# Altium project Magnetovision_2D_256_2.PrjPcb
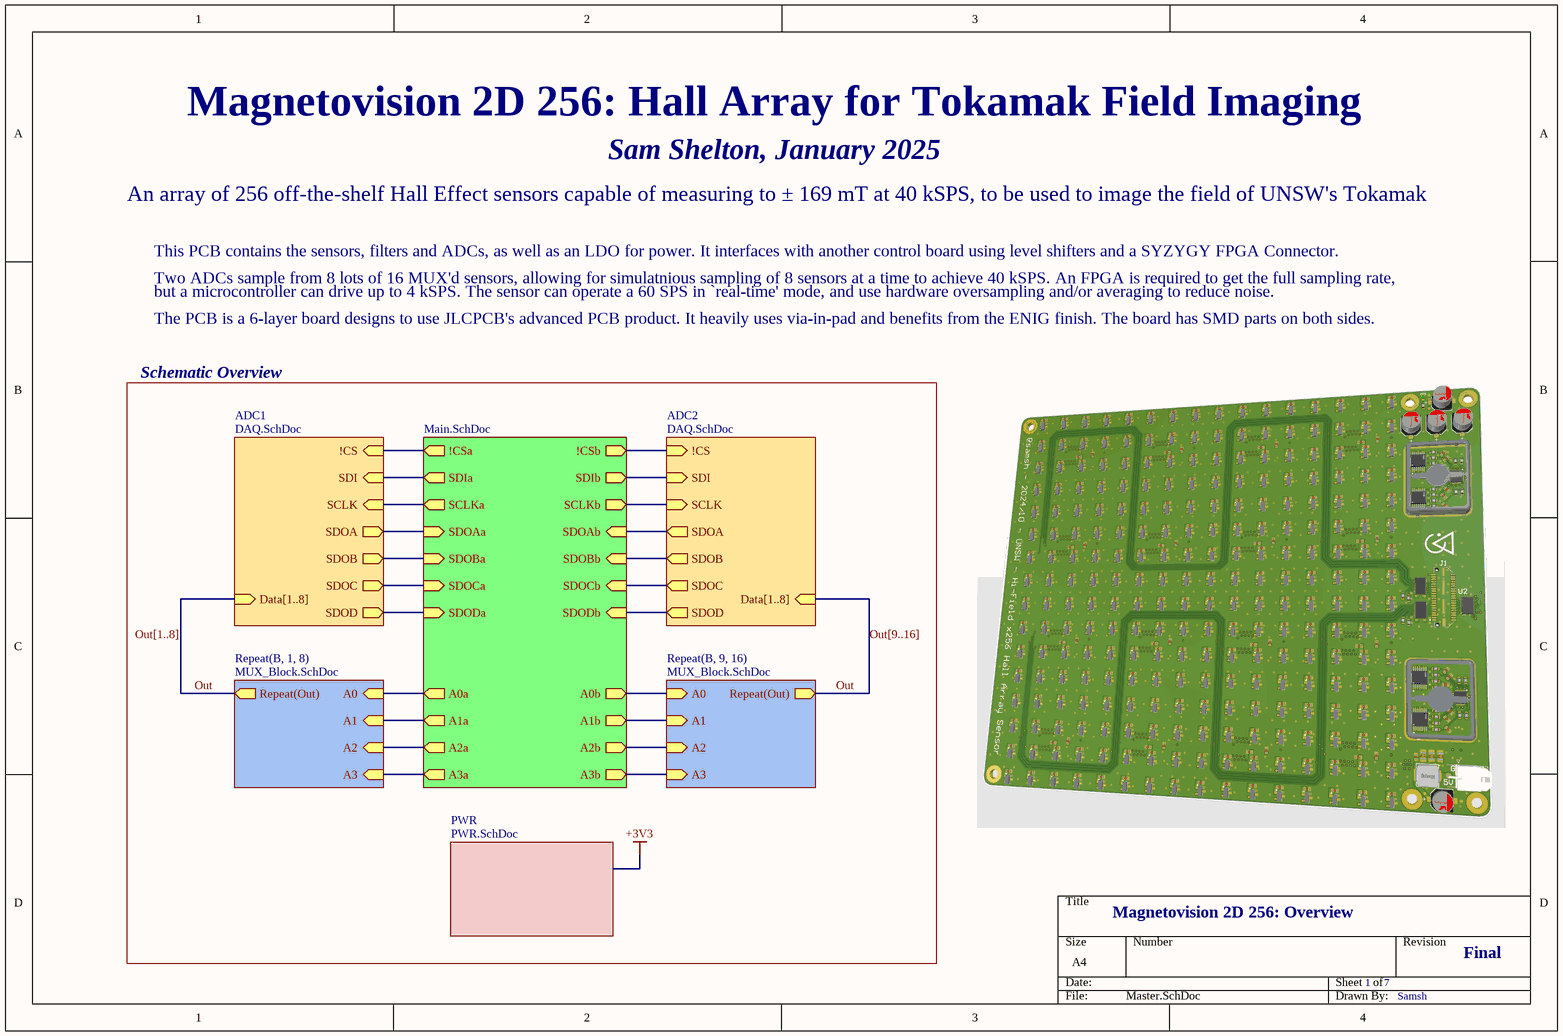
[diagram p0: Master.SchDoc]
7 sheets, 756 parts. Net scope: hierarchical (ports join the sheet entries above them; power ports are global).
Board file: Mag256_9mm.PcbDoc
Sheets:
  Master.SchDoc
    ADC1 = DAQ.SchDoc
      F2 = PreDAQ_Filter.SchDoc
      F1 = PreDAQ_Filter.SchDoc
     = Main.SchDoc
    B1 = MUX_Block.SchDoc
      F1 = PostMUX_Filter.SchDoc
    B2 = MUX_Block.SchDoc
      F1 = PostMUX_Filter.SchDoc
    B3 = MUX_Block.SchDoc
      F1 = PostMUX_Filter.SchDoc
    B4 = MUX_Block.SchDoc
      F1 = PostMUX_Filter.SchDoc
    B5 = MUX_Block.SchDoc
      F1 = PostMUX_Filter.SchDoc
    B6 = MUX_Block.SchDoc
      F1 = PostMUX_Filter.SchDoc
    B7 = MUX_Block.SchDoc
      F1 = PostMUX_Filter.SchDoc
    B8 = MUX_Block.SchDoc
      F1 = PostMUX_Filter.SchDoc
    ADC2 = DAQ.SchDoc
      F2 = PreDAQ_Filter.SchDoc
      F1 = PreDAQ_Filter.SchDoc
    B9 = MUX_Block.SchDoc
      F1 = PostMUX_Filter.SchDoc
    B10 = MUX_Block.SchDoc
      F1 = PostMUX_Filter.SchDoc
    B11 = MUX_Block.SchDoc
      F1 = PostMUX_Filter.SchDoc
    B12 = MUX_Block.SchDoc
      F1 = PostMUX_Filter.SchDoc
    B13 = MUX_Block.SchDoc
      F1 = PostMUX_Filter.SchDoc
    B14 = MUX_Block.SchDoc
      F1 = PostMUX_Filter.SchDoc
    B15 = MUX_Block.SchDoc
      F1 = PostMUX_Filter.SchDoc
    B16 = MUX_Block.SchDoc
      F1 = PostMUX_Filter.SchDoc
    PWR = PWR.SchDoc

## Sheet Master.SchDoc
size A4; SheetNumber: 1; SheetTotal: 7

### Sub-sheets
ADC1 = DAQ.SchDoc: Data[1..8] (in), !CS (in), SDOA (out), SDI (in), SCLK (in), SDOB (out), SDOC (out), SDOD (out)
ADC2 = DAQ.SchDoc: Data[1..8] (in), !CS (in), SDOA (out), SDI (in), SCLK (in), SDOB (out), SDOC (out), SDOD (out)
PWR = PWR.SchDoc: no entries
Repeat(B, 1, 8) = MUX_Block.SchDoc: A0 (in), A1 (in), A2 (in), A3 (in), Repeat(Out) (out)
Repeat(B, 9, 16) = MUX_Block.SchDoc: A0 (in), A1 (in), A2 (in), A3 (in), Repeat(Out) (out)
? = Main.SchDoc: SDOAa (in), SDIa (out), !CSa (out), !CSb (out), SDOBa (in), A0a (out), A1a (out), A2a (out), A3a (out), A0b (out), A1b (out), A2b (out), A3b (out), SDOCa (in), SDODa (in), SCLKa (out), SDOAb (in), SDIb (out), SDOBb (in), SDOCb (in), SDODb (in), SCLKb (out)

### Nets
Out: sheet Repeat(B, 1, 8)/Repeat(Out), sheet Repeat(B, 9, 16)/Repeat(Out)
NetIC1_ADC1_18: sheet ADC1/!CS, sheet /!CSa
NetIC1_ADC1_21: sheet ADC1/SDI, sheet /SDIa
NetIC1_ADC1_22: sheet ADC1/SCLK, sheet /SCLKa
NetIC1_ADC2_18: sheet /!CSb, sheet ADC2/!CS
NetIC1_ADC2_21: sheet /SDIb, sheet ADC2/SDI
NetIC1_ADC2_22: sheet /SCLKb, sheet ADC2/SCLK
NetR1_ADC1_2: sheet ADC1/SDOC, sheet /SDOCa
NetR1_ADC2_2: sheet /SDOCb, sheet ADC2/SDOC
NetR2_ADC1_1: sheet ADC1/SDOB, sheet /SDOBa
NetR2_ADC2_1: sheet /SDOBb, sheet ADC2/SDOB
NetR3_ADC1_2: sheet ADC1/SDOD, sheet /SDODa
NetR3_ADC2_2: sheet /SDODb, sheet ADC2/SDOD
NetR4_ADC1_1: sheet ADC1/SDOA, sheet /SDOAa
NetR4_ADC2_1: sheet /SDOAb, sheet ADC2/SDOA
NetU1_15: sheet /A3a, sheet Repeat(B, 1, 8)/A3
NetU1_16: sheet /A2a, sheet Repeat(B, 1, 8)/A2
NetU1_17: sheet /A1a, sheet Repeat(B, 1, 8)/A1
NetU1_18: sheet /A0a, sheet Repeat(B, 1, 8)/A0
NetU3_15: sheet /A3b, sheet Repeat(B, 9, 16)/A3
NetU3_16: sheet /A2b, sheet Repeat(B, 9, 16)/A2
NetU3_17: sheet /A1b, sheet Repeat(B, 9, 16)/A1
NetU3_18: sheet /A0b, sheet Repeat(B, 9, 16)/A0

### Buses and harness runs
bus Out[1..8] = sheet ADC1/Data[1..8]
bus Out[9..16] = sheet ADC2/Data[1..8]

### Notes on the sheet
- Magnetovision 2D 256: Hall Array for Tokamak Field Imaging
- Sam Shelton, January 2025
- An array of 256 off-the-shelf Hall Effect sensors capable of measuring to ± 169 mT at 40 kSPS, to be used to image the field of UNSW's Tokamak
- This PCB contains the sensors, filters and ADCs, as well as an LDO for power. It interfaces with another control board using level shifters and a SYZYGY FPGA Connector.
- Two ADCs sample from 8 lots of 16 MUX'd sensors, allowing for simulatnious sampling of 8 sensors at a time to achieve 40 kSPS. An FPGA is required to get the full sampling rate,
- but a microcontroller can drive up to 4 kSPS. The sensor can operate a 60 SPS in `real-time' mode, and use hardware oversampling and/or averaging to reduce noise.
- Schematic Overview
- The PCB is a 6-layer board designs to use JLCPCB's advanced PCB product. It heavily uses via-in-pad and benefits from the ENIG finish. The board has SMD parts on both sides.
- Magnetovision 2D 256: Overview
- 1
- 7
- Final
- Samsh

## Sheet DAQ.SchDoc
size A4; SheetNumber: 3; SheetTotal: 7
Used 2 times, as channels ADC1, ADC2. Parts and nets are listed once, with the designators drawn on the sheet.
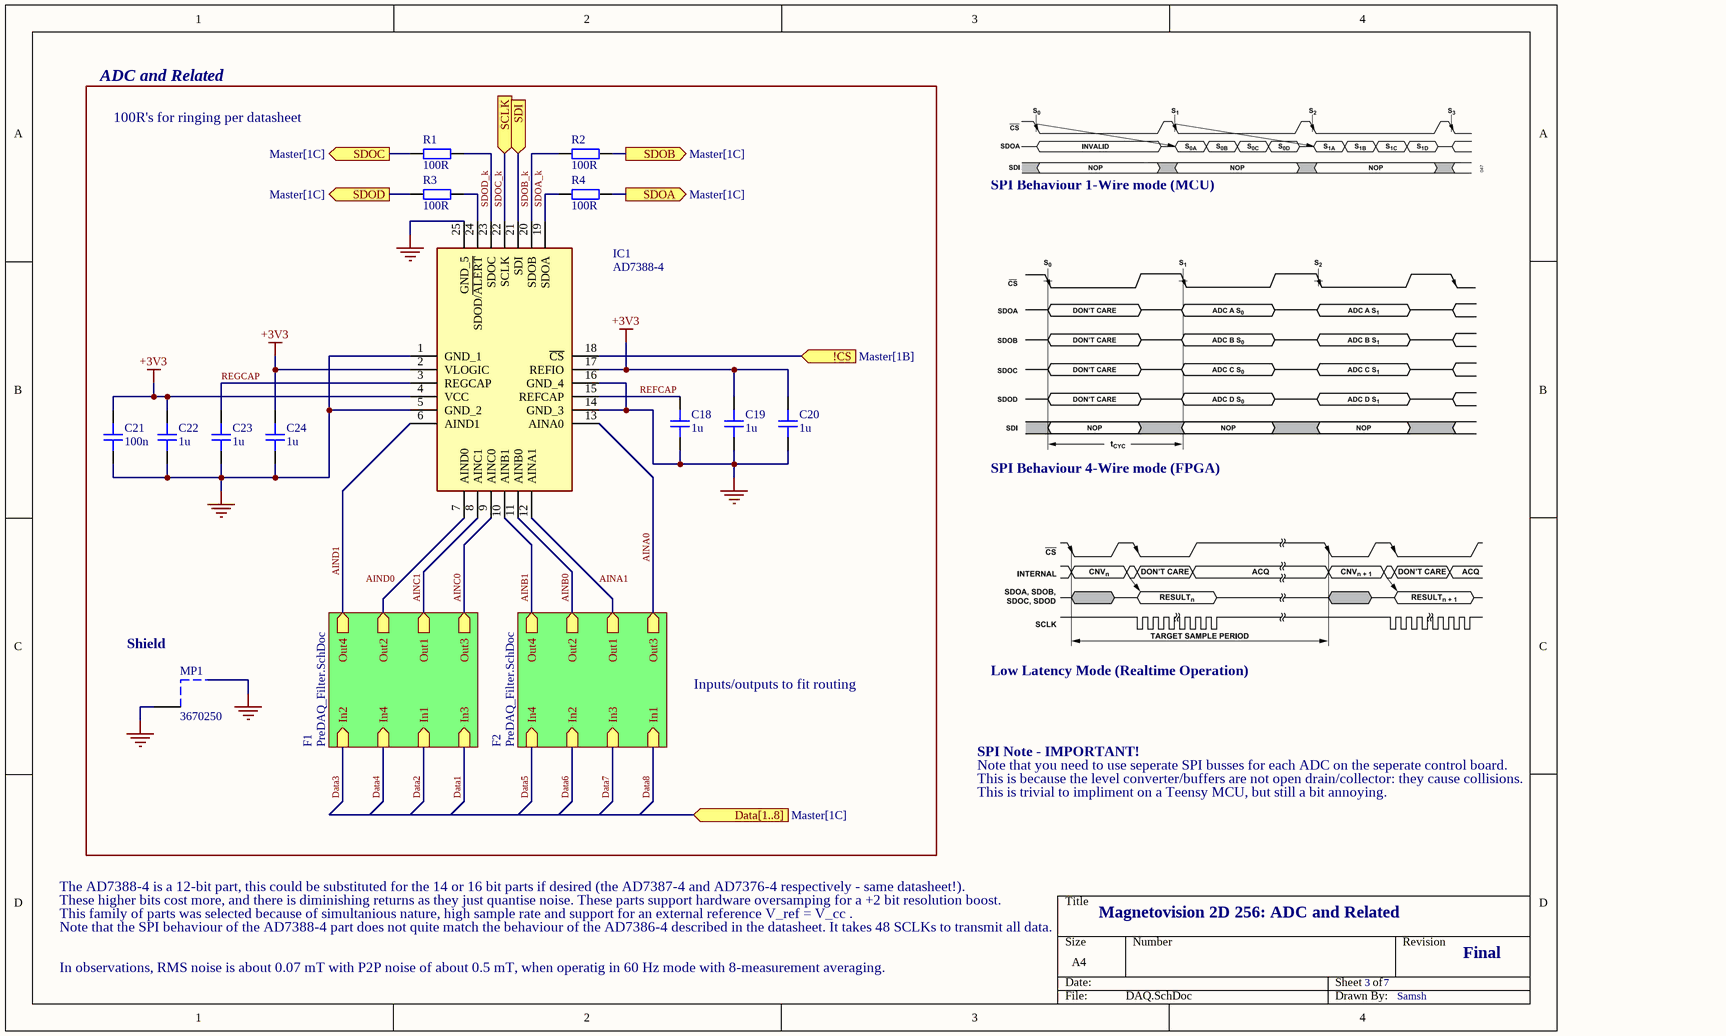
[diagram p1: DAQ.SchDoc]

### Parts
C18  1u  [CAP_0603]
C19  1u  [CAP_0603]
C20  1u  [CAP_0603]
C21  100n  [CAP_0603]
C22  1u  [CAP_0603]
C23  1u  [CAP_0603]
C24  1u  [CAP_0603]
IC1  AD7388-4  [QFN50P400X400X60-25N-D]
MP1  3670250  [3670250]
R1  100R  [RES_0603]
R2  100R  [RES_0603]
R3  100R  [RES_0603]
R4  100R  [RES_0603]

### Sub-sheets
F1 = PreDAQ_Filter.SchDoc: In1 (in), Out1 (out), In2 (in), Out2 (out), In4 (in), Out4 (out), In3 (in), Out3 (out)
F2 = PreDAQ_Filter.SchDoc: In1 (in), Out1 (out), In2 (in), Out2 (out), In4 (in), Out4 (out), In3 (in), Out3 (out)

### Ports
!CS (in, see Master[1B]), Data[1..8] (in, see Master[1C]), SCLK (in, see Master[1B]), SDI (in, see Master[1B]), SDOA (out, see Master[1C]), SDOB (out, see Master[1C]), SDOC (out, see Master[1C]), SDOD (out, see Master[1C])

### Nets
+3V3: C19.2 C20.2 C21.2 C22.2 C24.2 IC1.2(VLOGIC) IC1.4(VCC) IC1.17(REFIO)
GND: C18.1 C19.1 C20.1 C21.1 C22.1 C23.1 C24.1 IC1.1(GND_1) IC1.5(GND_2) IC1.14(GND_3) IC1.16(GND_4) IC1.25(GND_5) MP1.1
!CS: IC1.18(~{CS}) ; port !CS
AINA0: IC1.13(AINA0) ; sheet F2/Out3
AINA1: IC1.12(AINA1) ; sheet F2/Out1
AINB0: IC1.11(AINB0) ; sheet F2/Out2
AINB1: IC1.10(AINB1) ; sheet F2/Out4
AINC0: IC1.9(AINC0) ; sheet F1/Out3
AINC1: IC1.8(AINC1) ; sheet F1/Out1
AIND0: IC1.7(AIND0) ; sheet F1/Out2
AIND1: IC1.6(AIND1) ; sheet F1/Out4
REFCAP: C18.2 IC1.15(REFCAP)
REGCAP: C23.2 IC1.3(REGCAP)
SCLK: IC1.22(SCLK) ; port SCLK
SDI: IC1.21(SDI) ; port SDI
SDOA: R4.1 ; port SDOA
SDOA_k: IC1.19(SDOA) R4.2
SDOB: R2.1 ; port SDOB
SDOB_k: IC1.20(SDOB) R2.2
SDOC: R1.2 ; port SDOC
SDOC_k: IC1.23(SDOC) R1.1
SDOD: R3.2 ; port SDOD
SDOD_k: IC1.24(SDOD/~{ALERT}) R3.1

### Channels
ADC1: designators end in _ADC1; ports !CS=NetIC1_ADC1_18 SCLK=NetIC1_ADC1_22 SDI=NetIC1_ADC1_21 SDOA=NetR4_ADC1_1 SDOB=NetR2_ADC1_1 SDOC=NetR1_ADC1_2 SDOD=NetR3_ADC1_2
ADC2: designators end in _ADC2; ports !CS=NetIC1_ADC2_18 SCLK=NetIC1_ADC2_22 SDI=NetIC1_ADC2_21 SDOA=NetR4_ADC2_1 SDOB=NetR2_ADC2_1 SDOC=NetR1_ADC2_2 SDOD=NetR3_ADC2_2

### Notes on the sheet
- ADC and Related
- 100R's for ringing per datasheet
- SPI Behaviour 1-Wire mode (MCU)
- SPI Behaviour 4-Wire mode (FPGA)
- Shield
- Inputs/outputs to fit routing
- Low Latency Mode (Realtime Operation)
- Note that you need to use seperate SPI busses for each ADC on the seperate control board.
- This is because the level converter/buffers are not open drain/collector: they cause collisions.
- SPI Note - IMPORTANT!
- This is trivial to impliment on a Teensy MCU, but still a bit annoying.
- The AD7388-4 is a 12-bit part, this could be substituted for the 14 or 16 bit parts if desired (the AD7387-4 and AD7376-4 respectively - same datasheet!).
- These higher bits cost more, and there is diminishing returns as they just quantise noise. These parts support hardware oversamping for a +2 bit resolution boost.
- This family of parts was selected because of simultanious nature, high sample rate and support for an external reference V_ref = V_cc .
- Magnetovision 2D 256: ADC and Related
- In observations, RMS noise is about 0.07 mT with P2P noise of about 0.5 mT, when operatig in 60 Hz mode with 8-measurement averaging.
- Note that the SPI behaviour of the AD7388-4 part does not quite match the behaviour of the AD7386-4 described in the datasheet. It takes 48 SCLKs to transmit all data.
- 3
- 7
- Final
- Samsh

### Library data of the parts
C18-C24 = CMP-001-00085-1: Capacitor SMD 0603; Distributor Link: *; LCSC: *; Design Item ID: CAP_0603; Rating: *; Source: Schematic-Lib-PhilsLab.SchLib; Manufacturer Part Number: *; Manufacturer: *; Dielectric: *
IC1 = CMP-031-00040-2: Single-Ended Input, Quad, Simultaneous Sampling, 16-Bit, SAR ADC; Manufacturer_Name: Analog Devices; Height: 0.6mm; Source: SamacSys.SchLib; Manufacturer_Part_Number: AD7386-4BCPZ; Arrow Price/Stock: https://www.arrow.com/en/products/ad7386-4bcpz/analog-devices?region=nac; Arrow Part Number: AD7386-4; Mouser Price/Stock: https://www.mouser.co.uk/ProductDetail/Analog-Devices/AD7386-4BCPZ?qs=ST9lo4GX8V1C1Qgul%252B8gdQ%3D%3D; Datasheet Link: https://www.analog.com/AD7386-4/datasheet; Mouser Part Number: 584-AD7386-4BCPZ; Design Item ID: AD7386-4BCPZ
MP1 = CMP-03913-115851622-1: 3670250 Shield Cabinet Frame, 25Mm X 21Mm Rohs Compliant: Yes; Core Material: Steel; Max Operating Temperature: 125°C; Height: 4mm; RoHS: Compliant; Length: 25mm; Width: 21mm; NexarPartId: 115851622; Min Operating Temperature: -40°C
R1-R4 = CMP-009-00179-1: Resistor SMD 0603; Manufacturer Part Number: *; Distributor Link: *; Source: Schematic-Lib-PhilsLab.SchLib; Manufacturer: *; Design Item ID: RES_0603; LCSC: *

## Sheet PreDAQ_Filter.SchDoc
size A4; SheetNumber: 4; SheetTotal: 7
Used 4 times, as channels ADC1/F2, ADC1/F1, ADC2/F2, ADC2/F1. Parts and nets are listed once, with the designators drawn on the sheet.
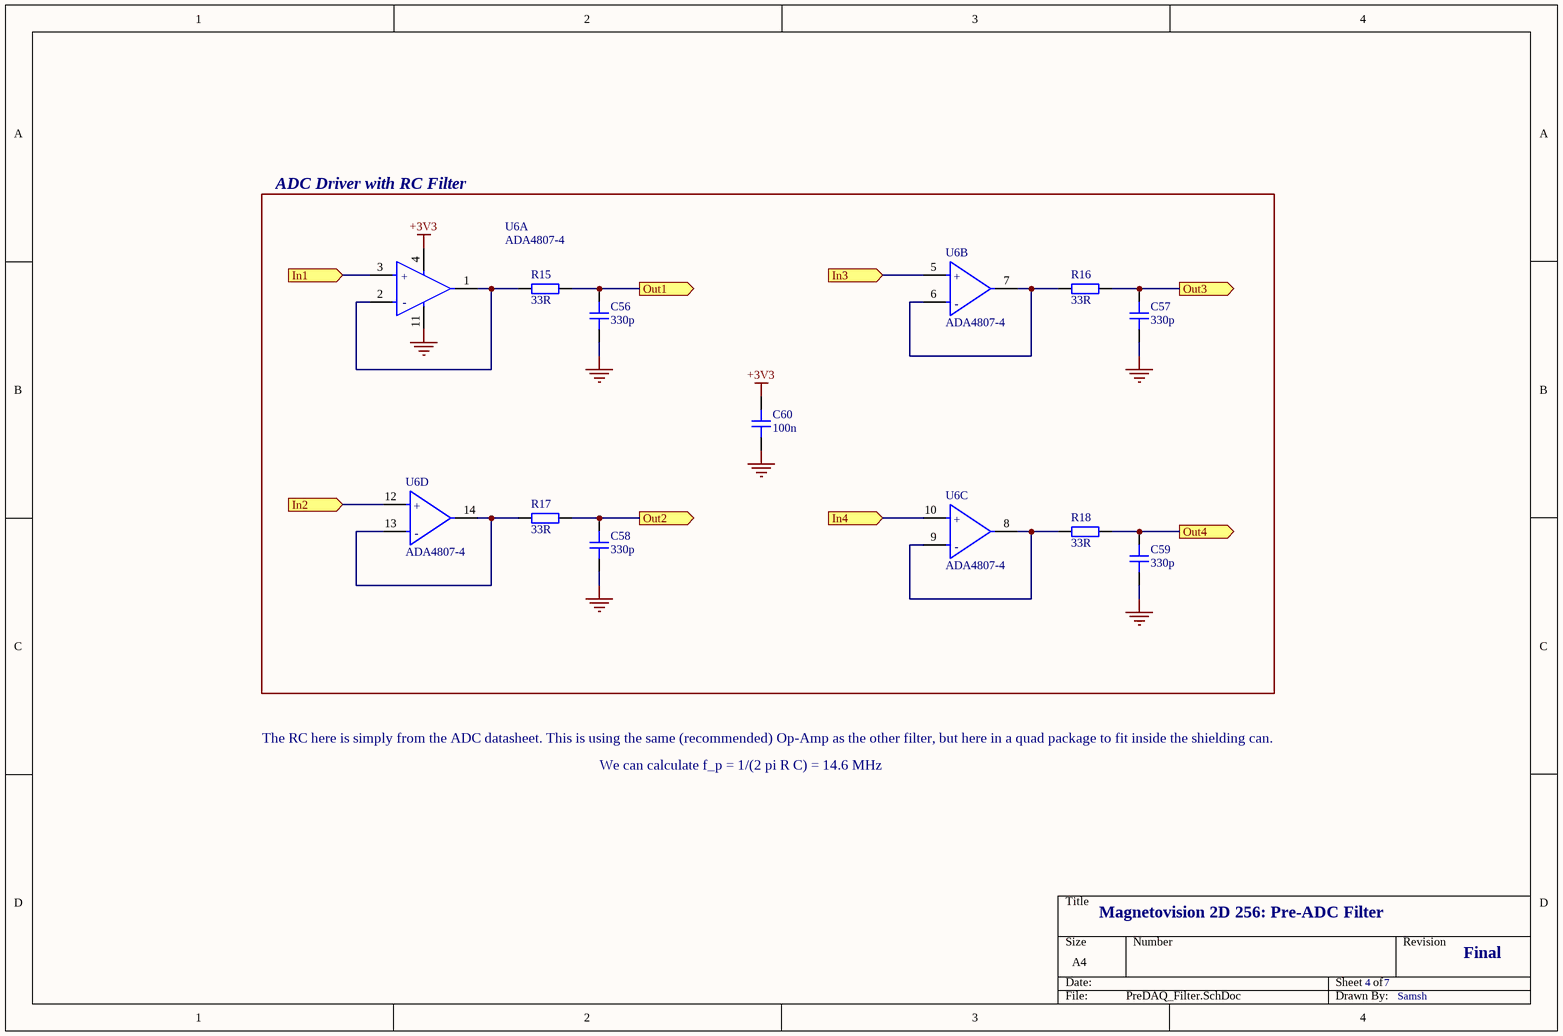
[diagram p2: PreDAQ_Filter.SchDoc]

### Parts
C56  330p  [CAP_0603]
C57  330p  [CAP_0603]
C58  330p  [CAP_0603]
C59  330p  [CAP_0603]
C60  100n  [CAP_0603]
R15  33R  [RES_0603]
R16  33R  [RES_0603]
R17  33R  [RES_0603]
R18  33R  [RES_0603]
U6  ADA4807-4  [FP-RU-14-IPC_A]  (parts A,B,C,D of 4)

### Blocks framed on the sheet
ADC Driver with RC Filter: C56-C60 R15-R18 U6

### Ports
In1 (in, see DAQ[2C]), In2 (in, see DAQ[1C]), In3 (in, see DAQ[2C]), In4 (in, see DAQ[1C]), Out1 (out, see DAQ[2C]), Out2 (out, see DAQ[1C]), Out3 (out, see DAQ[2C]), Out4 (out, see DAQ[1C])

### Nets
+3V3: C60.2 U6.4(+VS)
GND: C56.1 C57.1 C58.1 C59.1 C60.1 U6.11(-VS)
In1: U6.3(+IN1) ; port In1
In2: U6.12(+IN4) ; port In2
In3: U6.5(+IN2) ; port In3
In4: U6.10(+IN3) ; port In4
Out1: C56.2 R15.1 ; port Out1
Out2: C58.2 R17.1 ; port Out2
Out3: C57.2 R16.1 ; port Out3
Out4: C59.2 R18.1 ; port Out4
NetR15_2: R15.2 U6.1(VOUT1) U6.2(-IN1)
NetR16_2: R16.2 U6.6(-IN2) U6.7(VOUT2)
NetR17_2: R17.2 U6.13(-IN4) U6.14(VOUT4)
NetR18_2: R18.2 U6.8(VOUT3) U6.9(-IN3)

### Channels
ADC1/F2: designators end in _ADC1_F2; ports In1=Data8_ADC1 In2=Data6_ADC1 In3=Data7_ADC1 In4=Data5_ADC1 Out1=AINA1_ADC1 Out2=AINB0_ADC1 Out3=AINA0_ADC1 Out4=AINB1_ADC1
ADC1/F1: designators end in _ADC1_F1; ports In1=Data2_ADC1 In2=Data3_ADC1 In3=Data1_ADC1 In4=Data4_ADC1 Out1=AINC1_ADC1 Out2=AIND0_ADC1 Out3=AINC0_ADC1 Out4=AIND1_ADC1
ADC2/F2: designators end in _ADC2_F2; ports In1=Data8_ADC2 In2=Data6_ADC2 In3=Data7_ADC2 In4=Data5_ADC2 Out1=AINA1_ADC2 Out2=AINB0_ADC2 Out3=AINA0_ADC2 Out4=AINB1_ADC2
ADC2/F1: designators end in _ADC2_F1; ports In1=Data2_ADC2 In2=Data3_ADC2 In3=Data1_ADC2 In4=Data4_ADC2 Out1=AINC1_ADC2 Out2=AIND0_ADC2 Out3=AINC0_ADC2 Out4=AIND1_ADC2

### Notes on the sheet
- The RC here is simply from the ADC datasheet. This is using the same (recommended) Op-Amp as the other filter, but here in a quad package to fit inside the shielding can.
- We can calculate f_p = 1/(2 pi R C) = 14.6 MHz
- Magnetovision 2D 256: Pre-ADC Filter
- 4
- 7
- Final
- Samsh
- (in symbol CMP-09116-000241-1, part A) +; -
- (in symbol CMP-09116-000241-1, part B) +; -
- (in symbol CMP-09116-000241-1, part C) +; -
- (in symbol CMP-09116-000241-1, part D) +; -

### Library data of the parts
C56-C60 = CMP-001-00085-1: Capacitor SMD 0603; Distributor Link: *; LCSC: *; Design Item ID: CAP_0603; Rating: *; Source: Schematic-Lib-PhilsLab.SchLib; Manufacturer Part Number: *; Manufacturer: *; Dielectric: *
R15-R18 = CMP-009-00179-1: Resistor SMD 0603; Manufacturer Part Number: *; Distributor Link: *; Source: Schematic-Lib-PhilsLab.SchLib; Manufacturer: *; Design Item ID: RES_0603; LCSC: *
U6 = CMP-09116-000241-1: IC OPAMP VFB 4 CIRCUIT 14TSSOP; Input Bias Current: 1.2uA; Min Supply Voltage: 2.7V; -3db Bandwidth: 180MHz; Number of Circuits: 4; Gain Bandwidth Product: 170MHz; Dual Supply Voltage: 5V; Power Supply Rejection Ratio (PSRR): 98dB; Common Mode Rejection Ratio: 96dB; Output Current per Channel: 80mA; Input Offset Voltage (Vos): 140uV; Voltage Gain: 130dB; Slew Rate: 225V/µs; Max Supply Voltage: 11V; Operating Supply Current: 1mA; Lead Free: Contains Lead; Number of Pins: 14; Packaging: Rail/Tube; Mount: Surface Mount; Bandwidth: 180MHz; RoHS Compliant: Yes; Max Operating Temperature: 125°C; Min Operating Temperature: -40°C; Number of Amplifiers: 4; REACH SVHC: No SVHC; Case/Package: TSSOP

## Sheet Main.SchDoc
size A4; SheetNumber: 2; SheetTotal: 7
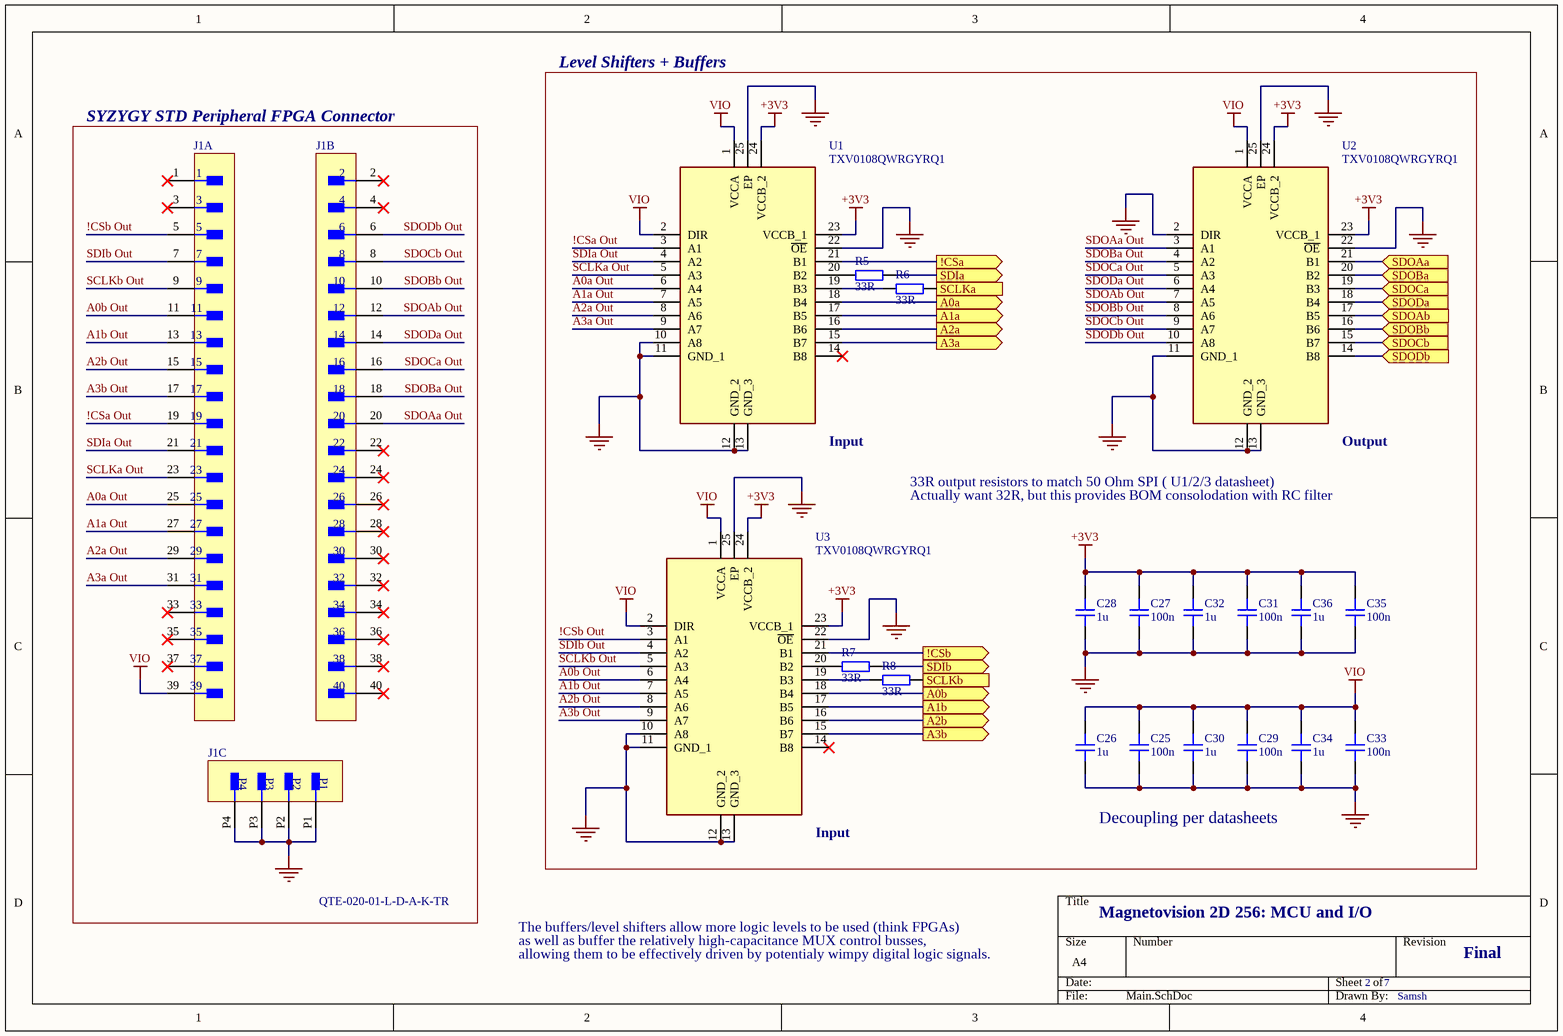
[diagram p3: Main.SchDoc]

### Parts
C25  100n  [CAP_0603]
C26  1u  [CAP_0603]
C27  100n  [CAP_0603]
C28  1u  [CAP_0603]
C29  100n  [CAP_0603]
C30  1u  [CAP_0603]
C31  100n  [CAP_0603]
C32  1u  [CAP_0603]
C33  100n  [CAP_0603]
C34  1u  [CAP_0603]
C35  100n  [CAP_0603]
C36  1u  [CAP_0603]
J1  QTE-020-01-L-D-A-K-TR  [FP-QTE-020-01-L-D-A-K-TR_MFG]  (value not drawn)  (parts A,B,C of 3)
R5  33R  [RES_0603]
R6  33R  [RES_0603]
R7  33R  [RES_0603]
R8  33R  [RES_0603]
U1  TXV0108QWRGYRQ1  [TXV0108QWRGYRQ1]
U2  TXV0108QWRGYRQ1  [TXV0108QWRGYRQ1]
U3  TXV0108QWRGYRQ1  [TXV0108QWRGYRQ1]

### Blocks framed on the sheet
SYZYGY STD Peripheral FPGA Connector: J1

### Ports
!CSa (out, see Master[2B]), !CSb (out, see Master[2B]), A0a (out, see Master[2C]), A0b (out, see Master[2C]), A1a (out, see Master[2C]), A1b (out, see Master[2C]), A2a (out, see Master[2C]), A2b (out, see Master[2C]), A3a (out, see Master[2D]), A3b (out, see Master[2D]), SCLKa (out, see Master[2B]), SCLKb (out, see Master[2B]), SDIa (out, see Master[2B]), SDIb (out, see Master[2B]), SDOAa (in, see Master[2C]), SDOAb (in, see Master[2C]), SDOBa (in, see Master[2C]), SDOBb (in, see Master[2C]), SDOCa (in, see Master[2C]), SDOCb (in, see Master[2C]), SDODa (in, see Master[2C]), SDODb (in, see Master[2C])

### Nets
+3V3: C27.2 C28.2 C31.2 C32.2 C35.2 C36.2 U1.23(VCCB_1) U1.24(VCCB_2) U2.23(VCCB_1) U2.24(VCCB_2) U3.23(VCCB_1) U3.24(VCCB_2)
GND: C25.1 C26.1 C27.1 C28.1 C29.1 C30.1 C31.1 C32.1 C33.1 C34.1 C35.1 C36.1 J1.P1 J1.P2 J1.P3 J1.P4 U1.10(A8) U1.11(GND_1) U1.12(GND_2) U1.13(GND_3) U1.22(~{OE}) U1.25(EP) U2.2(DIR) U2.11(GND_1) U2.12(GND_2) U2.13(GND_3) U2.22(~{OE}) U2.25(EP) U3.10(A8) U3.11(GND_1) U3.12(GND_2) U3.13(GND_3) U3.22(~{OE}) U3.25(EP)
VIO: C25.2 C26.2 C29.2 C30.2 C33.2 C34.2 J1.39 U1.1(VCCA) U1.2(DIR) U2.1(VCCA) U3.1(VCCA) U3.2(DIR)
!CSa Out: J1.19 U1.3(A1)
!CSb Out: J1.5 U3.3(A1)
A0a Out: J1.25 U1.6(A4)
A0b Out: J1.11 U3.6(A4)
A1a Out: J1.27 U1.7(A5)
A1b Out: J1.13 U3.7(A5)
A2a Out: J1.29 U1.8(A6)
A2b Out: J1.15 U3.8(A6)
A3a Out: J1.31 U1.9(A7)
A3b Out: J1.17 U3.9(A7)
SCLKa Out: J1.23 U1.5(A3)
SCLKb Out: J1.9 U3.5(A3)
SDIa Out: J1.21 U1.4(A2)
SDIb Out: J1.7 U3.4(A2)
SDOAa Out: J1.20 U2.3(A1)
SDOAb Out: J1.12 U2.7(A5)
SDOBa Out: J1.18 U2.4(A2)
SDOBb Out: J1.10 U2.8(A6)
SDOCa Out: J1.16 U2.5(A3)
SDOCb Out: J1.8 U2.9(A7)
SDODa Out: J1.14 U2.6(A4)
SDODb Out: J1.6 U2.10(A8)
NetIC1_ADC1_18: U1.21(B1) ; port !CSa
NetIC1_ADC1_21: R5.1 ; port SDIa
NetIC1_ADC1_22: R6.1 ; port SCLKa
NetIC1_ADC2_18: U3.21(B1) ; port !CSb
NetIC1_ADC2_21: R7.1 ; port SDIb
NetIC1_ADC2_22: R8.1 ; port SCLKb
NetR1_ADC1_2: U2.19(B3) ; port SDOCa
NetR1_ADC2_2: U2.15(B7) ; port SDOCb
NetR2_ADC1_1: U2.20(B2) ; port SDOBa
NetR2_ADC2_1: U2.16(B6) ; port SDOBb
NetR3_ADC1_2: U2.18(B4) ; port SDODa
NetR3_ADC2_2: U2.14(B8) ; port SDODb
NetR4_ADC1_1: U2.21(B1) ; port SDOAa
NetR4_ADC2_1: U2.17(B5) ; port SDOAb
NetR5_2: R5.2 U1.20(B2)
NetR6_2: R6.2 U1.19(B3)
NetR7_2: R7.2 U3.20(B2)
NetR8_2: R8.2 U3.19(B3)
NetU1_15: U1.15(B7) ; port A3a
NetU1_16: U1.16(B6) ; port A2a
NetU1_17: U1.17(B5) ; port A1a
NetU1_18: U1.18(B4) ; port A0a
NetU3_15: U3.15(B7) ; port A3b
NetU3_16: U3.16(B6) ; port A2b
NetU3_17: U3.17(B5) ; port A1b
NetU3_18: U3.18(B4) ; port A0b

Not connected (* = marked no-connect by the designer): J1 1* 2* 3* 4* 22* 24* 26* 28* 30* 32* 33* 34* 35* 36* 37* 38* 40*; U1 14(B8)*; U3 14(B8)*

### Notes on the sheet
- Level Shifters + Buffers
- (near U1) Input
- (near U2) Output
- (near U2) 33R output resistors to match 50 Ohm SPI ( U1/2/3 datasheet)
- Actually want 32R, but this provides BOM consolodation with RC filter
- (near U3) Input
- Decoupling per datasheets
- Magnetovision 2D 256: MCU and I/O
- The buffers/level shifters allow more logic levels to be used (think FPGAs)
- as well as buffer the relatively high-capacitance MUX control busses,
- allowing them to be effectively driven by potentialy wimpy digital logic signals.
- 2
- 7
- Final
- Samsh

### Library data of the parts
C25-C36 = CMP-001-00085-1: Capacitor SMD 0603; Distributor Link: *; LCSC: *; Design Item ID: CAP_0603; Rating: *; Source: Schematic-Lib-PhilsLab.SchLib; Manufacturer Part Number: *; Manufacturer: *; Dielectric: *
J1 = CMP-00575-09351342-1: Board to Board & Mezzanine Connectors Q Strip High-Speed Ground Plane Header, 0.80mm Pitch; Manufacturer Lifecycle Status: PRODUCTION; Voltage Rating (AC): 225V; Row Spacing: 3.94mm; Number of Contacts: 40; Gender: Male; Pitch: 800µm; Current Rating: 2A; ComponentLink3Description: Package URL; Lifecycle Status: Production; Min Operating Temperature: -55°C; Housing Material: Polymer; ComponentLink2Description: Datasheet URL; Insulation Material: Polyester; ComponentLink2URL: https://suddendocs.samtec.com/catalog_english/qte.pdf; Housing Color: Black; Voltage Rating: 225V; ComponentLink3URL: https://suddendocs.samtec.com/prints/qte-xxx-xx-xxx-d-xxx-footprint.pdf; Depth: 5.97mm; Number of Rows: 2; ComponentLink1Description: Manufacturer URL; Radiation Hardening: No; Length: 20mm; Mount: Surface Mount; Max Voltage Rating (AC): 225V; Orientation: Straight; Max Operating Temperature: 125°C; REACH SVHC: No SVHC; Contact Material: Gold, Nickel; Termination: Solder; ComponentLink1URL: http://www.samtec.com/; Height: 4.347mm; RoHS: Compliant; Contact Plating: Gold
R5-R8 = CMP-009-00179-1: Resistor SMD 0603; Manufacturer Part Number: *; Distributor Link: *; Source: Schematic-Lib-PhilsLab.SchLib; Manufacturer: *; Design Item ID: RES_0603; LCSC: *
U1-U3 = TXV0108QWRGYRQ1: Integrated Circuit; Manufacturer_Name: Texas Instruments; Datasheet Link: https://www.ti.com/lit/ds/symlink/txv0108-q1.pdf?ts=1721444850822&ref_url=https%253A%252F%252Fwww.mouser.cn%252F; Height: 1mm; Manufacturer_Part_Number: TXV0108QWRGYRQ1

## Sheet MUX_Block.SchDoc
size A4; SheetNumber: 5; SheetTotal: 7
Used 16 times, as channels B1, B2, B3, B4, B5, B6, B7, B8, B9, B10, B11, B12, B13, B14, B15, B16. Parts and nets are listed once, with the designators drawn on the sheet.
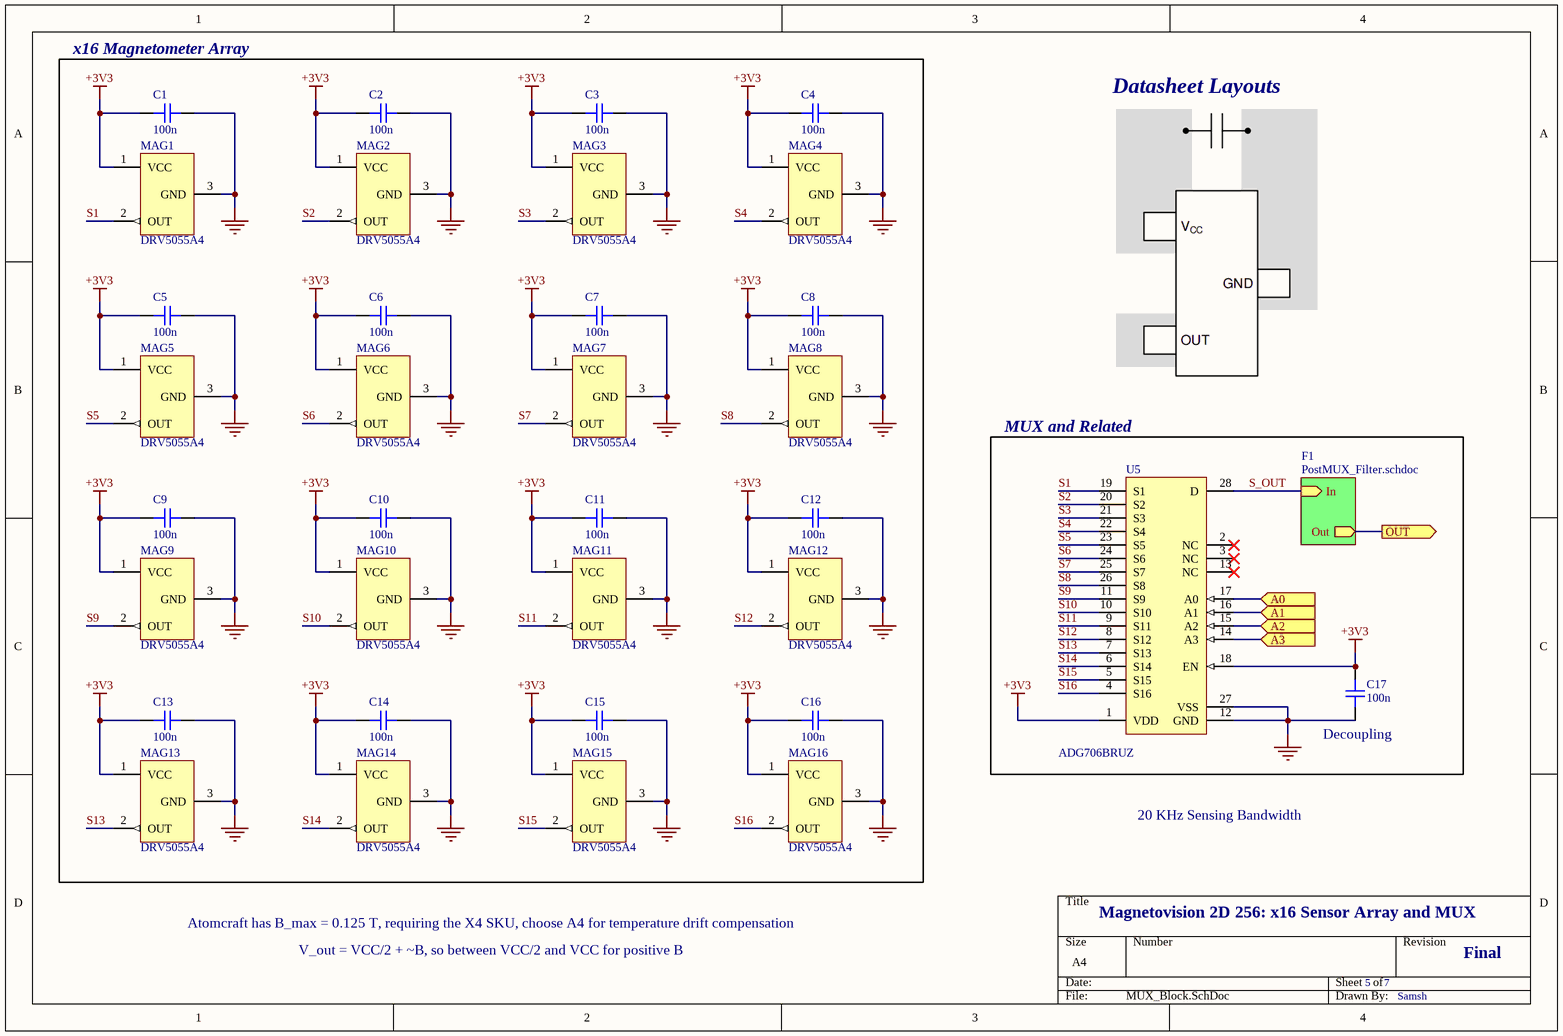
[diagram p4: MUX_Block.SchDoc]

### Parts
C1  100n  [CAP_0603]
C2  100n  [CAP_0603]
C3  100n  [CAP_0603]
C4  100n  [CAP_0603]
C5  100n  [CAP_0603]
C6  100n  [CAP_0603]
C7  100n  [CAP_0603]
C8  100n  [CAP_0603]
C9  100n  [CAP_0603]
C10  100n  [CAP_0603]
C11  100n  [CAP_0603]
C12  100n  [CAP_0603]
C13  100n  [CAP_0603]
C14  100n  [CAP_0603]
C15  100n  [CAP_0603]
C16  100n  [CAP_0603]
C17  100n  [CAP_0603]
MAG1  DRV5055A4  [SOT100P237X112-3N]
MAG2  DRV5055A4  [SOT100P237X112-3N]
MAG3  DRV5055A4  [SOT100P237X112-3N]
MAG4  DRV5055A4  [SOT100P237X112-3N]
MAG5  DRV5055A4  [SOT100P237X112-3N]
MAG6  DRV5055A4  [SOT100P237X112-3N]
MAG7  DRV5055A4  [SOT100P237X112-3N]
MAG8  DRV5055A4  [SOT100P237X112-3N]
MAG9  DRV5055A4  [SOT100P237X112-3N]
MAG10  DRV5055A4  [SOT100P237X112-3N]
MAG11  DRV5055A4  [SOT100P237X112-3N]
MAG12  DRV5055A4  [SOT100P237X112-3N]
MAG13  DRV5055A4  [SOT100P237X112-3N]
MAG14  DRV5055A4  [SOT100P237X112-3N]
MAG15  DRV5055A4  [SOT100P237X112-3N]
MAG16  DRV5055A4  [SOT100P237X112-3N]
U5  ADG706BRUZ  [ADI-RU-28_M]

### Blocks framed on the sheet
x16 Magnetometer Array: C1-C16 MAG1-MAG16
MUX and Related: C17 U5

### Sub-sheets
F1 = PostMUX_Filter.schdoc: In (in), Out (out)

### Ports
A0 (in, see Master[1C]), A1 (in, see Master[1C]), A2 (in, see Master[1C]), A3 (in, see Master[1D]), OUT (out, see Master[1C], PostMUX_Filter[2B])

### Nets
+3V3: C1.1 C2.1 C3.1 C4.1 C5.1 C6.1 C7.1 C8.1 C9.1 C10.1 C11.1 C12.1 C13.1 C14.1 C15.1 C16.1 C17.2 MAG1.1(VCC) MAG2.1(VCC) MAG3.1(VCC) MAG4.1(VCC) MAG5.1(VCC) MAG6.1(VCC) MAG7.1(VCC) MAG8.1(VCC) MAG9.1(VCC) MAG10.1(VCC) MAG11.1(VCC) MAG12.1(VCC) MAG13.1(VCC) MAG14.1(VCC) MAG15.1(VCC) MAG16.1(VCC) U5.1(VDD) U5.18(EN)
GND: C1.2 C2.2 C3.2 C4.2 C5.2 C6.2 C7.2 C8.2 C9.2 C10.2 C11.2 C12.2 C13.2 C14.2 C15.2 C16.2 C17.1 MAG1.3(GND) MAG2.3(GND) MAG3.3(GND) MAG4.3(GND) MAG5.3(GND) MAG6.3(GND) MAG7.3(GND) MAG8.3(GND) MAG9.3(GND) MAG10.3(GND) MAG11.3(GND) MAG12.3(GND) MAG13.3(GND) MAG14.3(GND) MAG15.3(GND) MAG16.3(GND) U5.12(GND) U5.27(VSS)
A0: U5.17(A0) ; port A0
A1: U5.16(A1) ; port A1
A2: U5.15(A2) ; port A2
A3: U5.14(A3) ; port A3
OUT: port OUT, sheet F1/Out
S1: MAG1.2(OUT) U5.19(S1)
S2: MAG2.2(OUT) U5.20(S2)
S3: MAG3.2(OUT) U5.21(S3)
S4: MAG4.2(OUT) U5.22(S4)
S5: MAG5.2(OUT) U5.23(S5)
S6: MAG6.2(OUT) U5.24(S6)
S7: MAG7.2(OUT) U5.25(S7)
S8: MAG8.2(OUT) U5.26(S8)
S9: MAG9.2(OUT) U5.11(S9)
S10: MAG10.2(OUT) U5.10(S10)
S11: MAG11.2(OUT) U5.9(S11)
S12: MAG12.2(OUT) U5.8(S12)
S13: MAG13.2(OUT) U5.7(S13)
S14: MAG14.2(OUT) U5.6(S14)
S15: MAG15.2(OUT) U5.5(S15)
S16: MAG16.2(OUT) U5.4(S16)
S_OUT: U5.28(D) ; sheet F1/In

Not connected (* = marked no-connect by the designer): U5 2(NC)* 3(NC)* 13(NC)*

### Channels
B1: designators end in _B1; ports A0=NetU1_18 A1=NetU1_17 A2=NetU1_16 A3=NetU1_15 OUT=Out1
B2: designators end in _B2; ports A0=NetU1_18 A1=NetU1_17 A2=NetU1_16 A3=NetU1_15 OUT=Out2
B3: designators end in _B3; ports A0=NetU1_18 A1=NetU1_17 A2=NetU1_16 A3=NetU1_15 OUT=Out3
B4: designators end in _B4; ports A0=NetU1_18 A1=NetU1_17 A2=NetU1_16 A3=NetU1_15 OUT=Out4
B5: designators end in _B5; ports A0=NetU1_18 A1=NetU1_17 A2=NetU1_16 A3=NetU1_15 OUT=Out5
B6: designators end in _B6; ports A0=NetU1_18 A1=NetU1_17 A2=NetU1_16 A3=NetU1_15 OUT=Out6
B7: designators end in _B7; ports A0=NetU1_18 A1=NetU1_17 A2=NetU1_16 A3=NetU1_15 OUT=Out7
B8: designators end in _B8; ports A0=NetU1_18 A1=NetU1_17 A2=NetU1_16 A3=NetU1_15 OUT=Out8
B9: designators end in _B9; ports A0=NetU3_18 A1=NetU3_17 A2=NetU3_16 A3=NetU3_15 OUT=Out9
B10: designators end in _B10; ports A0=NetU3_18 A1=NetU3_17 A2=NetU3_16 A3=NetU3_15 OUT=Out10
B11: designators end in _B11; ports A0=NetU3_18 A1=NetU3_17 A2=NetU3_16 A3=NetU3_15 OUT=Out11
B12: designators end in _B12; ports A0=NetU3_18 A1=NetU3_17 A2=NetU3_16 A3=NetU3_15 OUT=Out12
B13: designators end in _B13; ports A0=NetU3_18 A1=NetU3_17 A2=NetU3_16 A3=NetU3_15 OUT=Out13
B14: designators end in _B14; ports A0=NetU3_18 A1=NetU3_17 A2=NetU3_16 A3=NetU3_15 OUT=Out14
B15: designators end in _B15; ports A0=NetU3_18 A1=NetU3_17 A2=NetU3_16 A3=NetU3_15 OUT=Out15
B16: designators end in _B16; ports A0=NetU3_18 A1=NetU3_17 A2=NetU3_16 A3=NetU3_15 OUT=Out16

### Notes on the sheet
- Datasheet Layouts
- (near C17) Decoupling
- 20 KHz Sensing Bandwidth
- Atomcraft has B_max = 0.125 T, requiring the X4 SKU, choose A4 for temperature drift compensation
- Magnetovision 2D 256: x16 Sensor Array and MUX
- V_out = VCC/2 + ~B, so between VCC/2 and VCC for positive B
- 5
- 7
- Final
- Samsh

### Library data of the parts
C1-C17 = CMP-001-00085-1: Capacitor SMD 0603; Distributor Link: *; LCSC: *; Design Item ID: CAP_0603; Rating: *; Source: Schematic-Lib-PhilsLab.SchLib; Manufacturer Part Number: *; Manufacturer: *; Dielectric: *
MAG1-MAG16 = CMP-010-00024-4: Hall Effect Sensor, 176mT Min, -1-1mA, Plastic/epoxy, Rectangular, 3 Pin, Surface Mount, DRV5055A4QDBZR; Nominal Supply Current: 6mA; Output Current: 1mA; Sensor Type: MAGNETIC FIELD SENSOR,HALL EFFECT; Max Supply Voltage: 7V; Nominal Supply Voltage: 5V; Min Supply Voltage: -300mV; Max Operating Temperature: 125°C; Pins: 3; RoHS Compliant: Yes; Mounting Technology: SMD; Case/Package: SOT-23; Min Operating Temperature: -40°C
U5 = CMP-0798-00221-1: 1.8 to 5.5 V / 2.5 V, CMOS Low-Voltage 2.5 Ohm, 16-Channel Multiplexer, -40 to 85 degC, 28-pin SOP (RU-28), Reel; Manufacturer: Analog Devices; PartNumber: ADG706BRUZ-REEL7; t transition (s): 40n; Bandwidth (Hz): 25M; Max Analog Signal Range: Vss to Vdd; Supply V Guar Performance: Dual_(+/-2.5V), Single_(+3V), Single_(+5V); Ron (ohms): 2.5; ComponentLink2URL: http://www.analog.com/static/imported-files/data_sheets/ADG706_707.pdf; PackageVersion: Mar-05; DatasheetVersion: Rev. A; Mounting Technology: Surface Mount; ComponentLink3URL: http://www.analog.com/static/imported-files/packages/249854663RU_28.pdf; Packing: Reel; PackageDescription: 28-Pin Thin Shrink Small Outline Package, Body 9.7 x 4.4 mm, Pitch 0.65 mm; ComponentLink1URL: http://www.analog.com/en/index.html; PackageReference: RU-28; ComponentLink2Description: Datasheet; ComponentLink1Description: Manufacturer URL; Code_JEDEC: MO-153-AE; ComponentLink3Description: Package Specification

## Sheet PostMUX_Filter.SchDoc
size A4; SheetNumber: 6; SheetTotal: 7
Used 16 times, as channels B1/F1, B2/F1, B3/F1, B4/F1, B5/F1, B6/F1, B7/F1, B8/F1, B9/F1, B10/F1, B11/F1, B12/F1, B13/F1, B14/F1, B15/F1, B16/F1. Parts and nets are listed once, with the designators drawn on the sheet.
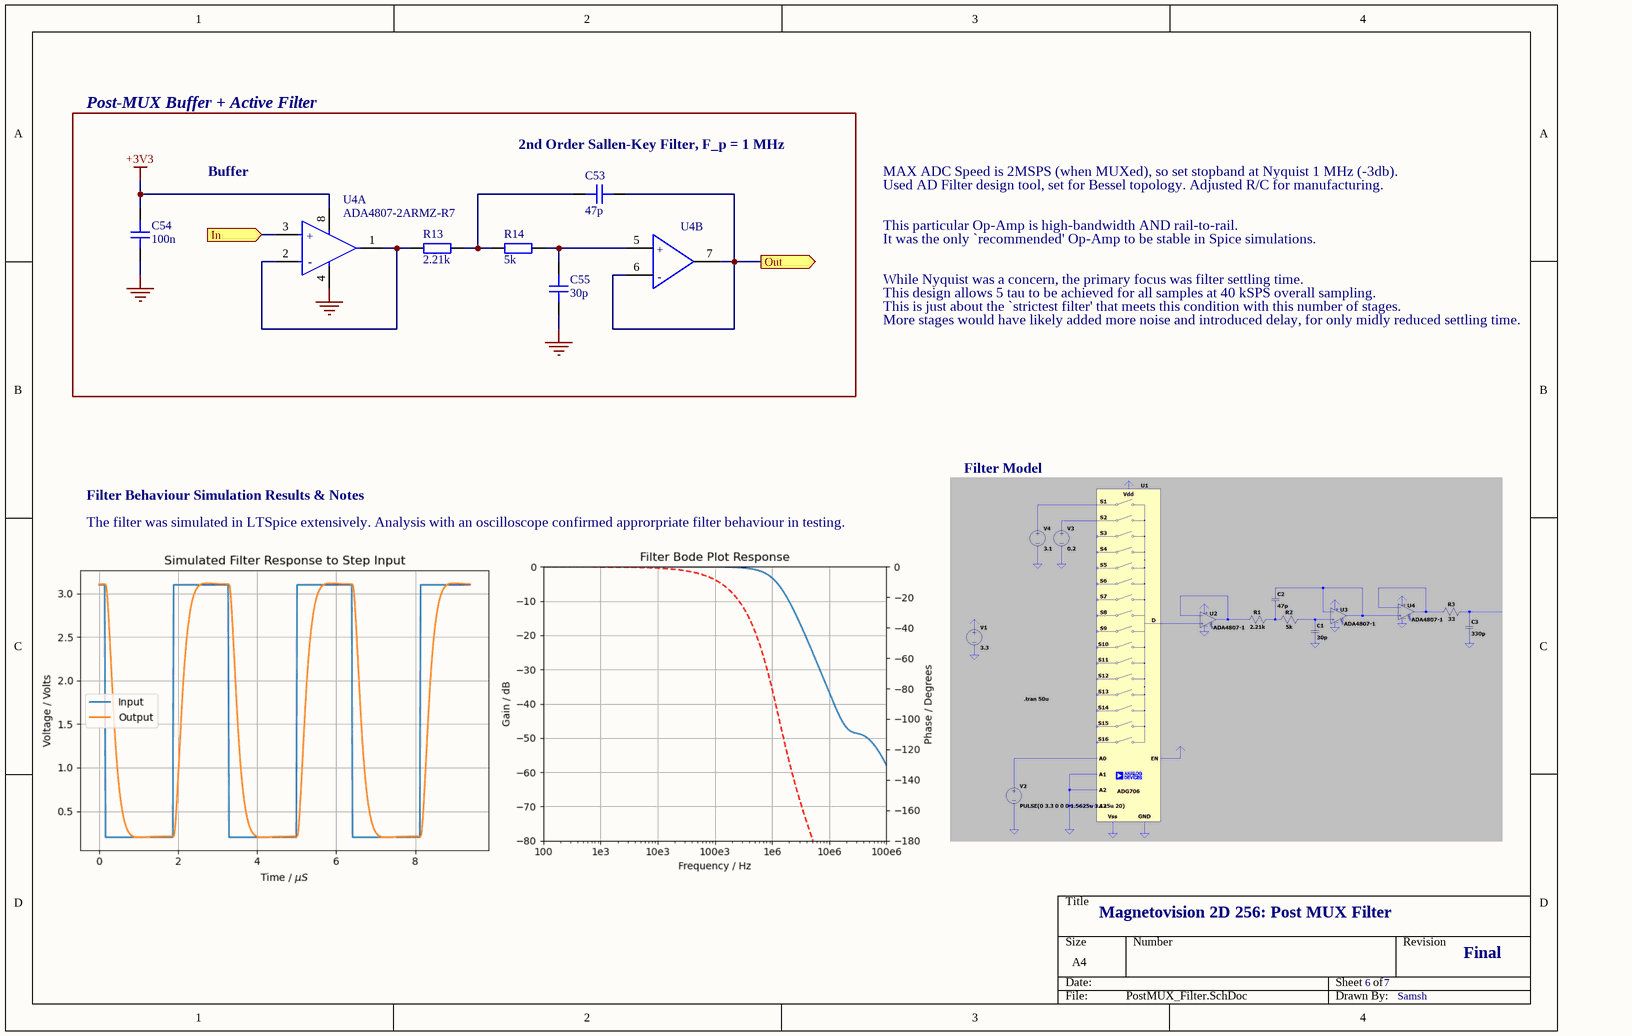
[diagram p5: PostMUX_Filter.SchDoc]

### Parts
C53  47p  [CAP_0603]
C54  100n  [CAP_0603]
C55  30p  [CAP_0603]
R13  2.21k  [RES_0603]
R14  5k  [RES_0603]
U4  ADA4807-2ARMZ-R7  [FP-RM-8-IPC_A]  (parts A,B of 2)

### Ports
In (in, see MUX_Block[4B]), Out (out, see MUX_Block[4C])

### Nets
+3V3: C54.2 U4.8(+VS)
GND: C54.1 C55.1 U4.4(-VS)
In: U4.3(+IN1) ; port In
Out: C53.2 U4.6(-IN2) U4.7(VOUT2) ; port Out
NetC53_1: C53.1 R13.1 R14.2
NetC55_2: C55.2 R14.1 U4.5(+IN2)
NetR13_2: R13.2 U4.1(VOUT1) U4.2(-IN1)

### Channels
B1/F1: designators end in _B1_F1; ports In=S_OUT_B1 Out=Out1
B2/F1: designators end in _B2_F1; ports In=S_OUT_B2 Out=Out2
B3/F1: designators end in _B3_F1; ports In=S_OUT_B3 Out=Out3
B4/F1: designators end in _B4_F1; ports In=S_OUT_B4 Out=Out4
B5/F1: designators end in _B5_F1; ports In=S_OUT_B5 Out=Out5
B6/F1: designators end in _B6_F1; ports In=S_OUT_B6 Out=Out6
B7/F1: designators end in _B7_F1; ports In=S_OUT_B7 Out=Out7
B8/F1: designators end in _B8_F1; ports In=S_OUT_B8 Out=Out8
B9/F1: designators end in _B9_F1; ports In=S_OUT_B9 Out=Out9
B10/F1: designators end in _B10_F1; ports In=S_OUT_B10 Out=Out10
B11/F1: designators end in _B11_F1; ports In=S_OUT_B11 Out=Out11
B12/F1: designators end in _B12_F1; ports In=S_OUT_B12 Out=Out12
B13/F1: designators end in _B13_F1; ports In=S_OUT_B13 Out=Out13
B14/F1: designators end in _B14_F1; ports In=S_OUT_B14 Out=Out14
B15/F1: designators end in _B15_F1; ports In=S_OUT_B15 Out=Out15
B16/F1: designators end in _B16_F1; ports In=S_OUT_B16 Out=Out16

### Notes on the sheet
- Post-MUX Buffer + Active Filter
- Buffer
- (near C53) 2nd Order Sallen-Key Filter, F_p = 1 MHz
- MAX ADC Speed is 2MSPS (when MUXed), so set stopband at Nyquist 1 MHz (-3db).
- Used AD Filter design tool, set for Bessel topology. Adjusted R/C for manufacturing.
- This particular Op-Amp is high-bandwidth AND rail-to-rail.
- It was the only `recommended' Op-Amp to be stable in Spice simulations.
- While Nyquist was a concern, the primary focus was filter settling time.
- This design allows 5 tau to be achieved for all samples at 40 kSPS overall sampling.
- This is just about the `strictest filter' that meets this condition with this number of stages.
- More stages would have likely added more noise and introduced delay, for only midly reduced settling time.
- Filter Behaviour Simulation Results & Notes
- Filter Model
- The filter was simulated in LTSpice extensively. Analysis with an oscilloscope confirmed approrpriate filter behaviour in testing.
- Magnetovision 2D 256: Post MUX Filter
- 6
- 7
- Final
- Samsh
- (in symbol CMP-09116-000141-1, part A) +; -
- (in symbol CMP-09116-000141-1, part B) +; -

### Library data of the parts
C53-C55 = CMP-001-00085-1: Capacitor SMD 0603; Distributor Link: *; LCSC: *; Design Item ID: CAP_0603; Rating: *; Source: Schematic-Lib-PhilsLab.SchLib; Manufacturer Part Number: *; Manufacturer: *; Dielectric: *
R13 R14 = CMP-009-00179-1: Resistor SMD 0603; Manufacturer Part Number: *; Distributor Link: *; Source: Schematic-Lib-PhilsLab.SchLib; Manufacturer: *; Design Item ID: RES_0603; LCSC: *
U4 = CMP-09116-000141-1: IC OPAMP VFB 2 CIRCUIT 8MSOP; Operating Supply Current: 950uA; Input Bias Current: 1.2uA; Input Offset Voltage (Vos): 20uV; Power Supply Rejection Ratio (PSRR): 98dB; Max Dual Supply Voltage: 5V; Number of Circuits: 2; Min Dual Supply Voltage: 1.5V; Common Mode Rejection Ratio: 110dB; Output Current per Channel: 106mA; Slew Rate: 145V/µs; Max Supply Voltage: 10V; Voltage Gain: 130dB; Min Supply Voltage: 3V; -3db Bandwidth: 170MHz; Case/Package: MSOP; Lead Free: Contains Lead; Contact Plating: Tin; Max Operating Temperature: 125°C; Packaging: Tape and Reel; Number of Pins: 8; RoHS Compliant: Yes; Mount: Surface Mount; Min Operating Temperature: -40°C

## Sheet PWR.SchDoc
size A4; SheetNumber: 7; SheetTotal: 7
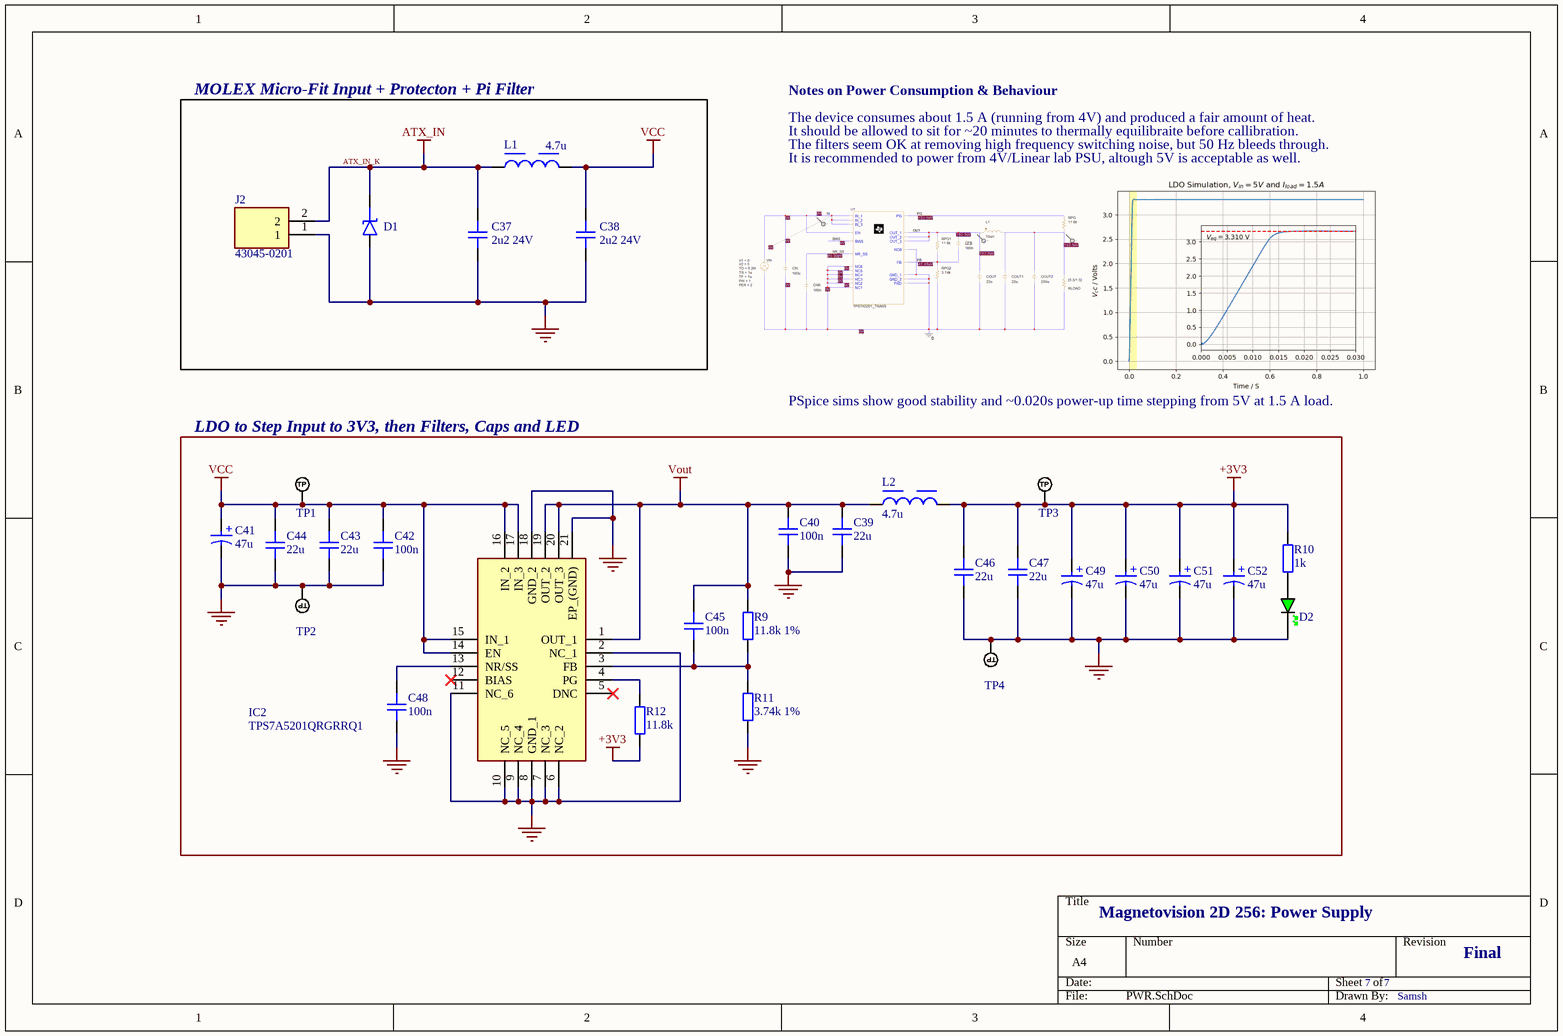
[diagram p6: PWR.SchDoc]

### Parts
C37  2u2 24V  [CAP_0805]
C38  2u2 24V  [CAP_0805]
C39  22u  [CAP_0805]
C40  100n  [CAP_0603]
C41  47u  [WCAP-ASLI_D6.3H5.5]
C42  100n  [CAP_0603]
C43  22u  [CAP_0805]
C44  22u  [CAP_0805]
C45  100n  [CAP_0603]
C46  22u  [CAP_0805]
C47  22u  [CAP_0805]
C48  100n  [CAP_0603]
C49  47u  [WCAP-ASLI_D6.3H5.5]
C50  47u  [WCAP-ASLI_D6.3H5.5]
C51  47u  [WCAP-ASLI_D6.3H5.5]
C52  47u  [WCAP-ASLI_D6.3H5.5]
D1  SMA Shottky  [DO-214AC-2 (SMA)]  (value not drawn)
D2  LED_0603_GREEN  [LED_0603_GREEN]  (value not drawn)
IC2  TPS7A5201QRGRRQ1  [QFN50P350X350X100-21N-D]
J2  43045-0201  [43045-02YY]
L1  4.7u  [WE-LHMI_7030]
L2  4.7u  [WE-LHMI_7030]
R9  11.8k 1%  [RES_0603]
R10  1k  [RES_0603]
R11  3.74k 1%  [RES_0603]
R12  11.8k  [RES_0603]
TP1  TEST_POINT_RND_1MM  [PAD_RND_1MM]  (value not drawn)  (no BOM)
TP2  TEST_POINT_RND_1MM  [PAD_RND_1MM]  (value not drawn)  (no BOM)
TP3  TEST_POINT_RND_1MM  [PAD_RND_1MM]  (value not drawn)  (no BOM)
TP4  TEST_POINT_RND_1MM  [PAD_RND_1MM]  (value not drawn)  (no BOM)

### Blocks framed on the sheet
MOLEX Micro-Fit Input + Protecton + Pi Filter: C37 C38 D1 J2 L1
LDO to Step Input to 3V3, then Filters, Caps and LED: C39-C52 D2 IC2 L2 R9-R12 TP1-TP4

### Nets
+3V3: C46.2 C47.2 C49.1(P) C50.1(P) C51.1(P) C52.1(P) L2.1 R10.2 R12.1 TP3.1(TP)
ATX_IN_K: C37.2 D1.K J2.2 L1.1  [also labelled ATX_IN]
GND: C37.1 C38.1 C39.1 C40.1 C41.2(N) C42.1 C43.1 C44.1 C46.1 C47.1 C48.1 C49.2(N) C50.2(N) C51.2(N) C52.2(N) D1.A D2.K IC2.2(NC_1) IC2.6(NC_2) IC2.7(NC_3) IC2.8(GND_1) IC2.9(NC_4) IC2.10(NC_5) IC2.11(NC_6) IC2.18(GND_2) IC2.21(EP_(GND)) J2.1 R11.1 TP2.1(TP) TP4.1(TP)
VCC: C38.2 C41.1(P) C42.2 C43.2 C44.2 IC2.14(EN) IC2.15(IN_1) IC2.16(IN_2) IC2.17(IN_3) L1.2 TP1.1(TP)
Vout: C39.2 C40.2 C45.2 IC2.1(OUT_1) IC2.19(OUT_2) IC2.20(OUT_3) L2.2 R9.2
NetC45_1: C45.1 IC2.3(FB) R9.1 R11.2
NetC48_2: C48.2 IC2.13(NR/SS)
NetD2_A: D2.A R10.1
NetIC2_4: IC2.4(PG) R12.2

Not connected (* = marked no-connect by the designer): IC2 5(DNC)* 12(BIAS)*

### Notes on the sheet
- Notes on Power Consumption & Behaviour
- The device consumes about 1.5 A (running from 4V) and produced a fair amount of heat.
- It should be allowed to sit for ~20 minutes to thermally equilibraite before callibration.
- The filters seem OK at removing high frequency switching noise, but 50 Hz bleeds through.
- It is recommended to power from 4V/Linear lab PSU, altough 5V is acceptable as well.
- PSpice sims show good stability and ~0.020s power-up time stepping from 5V at 1.5 A load.
- Magnetovision 2D 256: Power Supply
- 7
- Final
- Samsh
- (in symbol CMP-03913-53914608-1) +

### Library data of the parts
C37-C39 C43 C44 C46 C47 = CMP-001-00086-1: Capacitor SMD 0805; Source: Schematic-Lib-PhilsLab.SchLib; Rating: *; Manufacturer Part Number: *; Distributor Link: *; Design Item ID: CAP_0805; Manufacturer: *; LCSC: *; Dielectric: *
C40 C42 C45 C48 = CMP-001-00085-1: Capacitor SMD 0603; Distributor Link: *; LCSC: *; Design Item ID: CAP_0603; Rating: *; Source: Schematic-Lib-PhilsLab.SchLib; Manufacturer Part Number: *; Manufacturer: *; Dielectric: *
C41 C49-C52 = CMP-03913-53914608-1: 865080543009 Alum. Electrolytic Cap 47µF 35V 6.3mmV-Chip WCAP-ASLI; Lifetime 2000h +105°C; Life (Hours): 2000hours; Insulation Resistance: 2.12766MΩ; Ripple Current: 240mA; Impedance: 530mΩ; Leakage Current: 16.45µA; Tolerance: 20%; Polarity: Polar; ESR (Equivalent Series Resistance): 413.353mΩ; NexarPartId: 53914608; Case/Package: Radial; Capacitance: 47µF; Min Operating Temperature: -55°C; Voltage Rating: 35V; Diameter: 6.3mm; Width: 6.6mm; RoHS: Compliant; Ripple Current (AC): 240mA; Height: 5.5mm; Length: 5.5mm; Max Operating Temperature: 105°C; REACH SVHC: Unknown; Packaging: Tape & Reel (TR); Mount: Surface Mount; Voltage Rating (DC): 35V; Height - Seated (Max): 5.5118mm
D1 = CMP-004-00047-1: Diode Schottky SMD SMA (DO-214AA); Design Item ID: D_SCHOTTKY_SMA; Source: Schematic-Lib-PhilsLab.SchLib
D2 = CMP-004-00051-1: LED 0603 GREEN SMD; Source: Schematic-Lib-PhilsLab.SchLib; Design Item ID: LED_0603_GREEN
IC2 = TPS7A5201QRGRRQ1: Integrated Circuit; Manufacturer_Name: Texas Instruments; Datasheet Link: http://www.ti.com/lit/gpn/tps7a52-q1; Height: 1mm; Manufacturer_Part_Number: TPS7A5201QRGRRQ1; Mouser Part Number: 595-TPS7A5201QRGRRQ1; Mouser Price/Stock: https://www.mouser.co.uk/ProductDetail/Texas-Instruments/TPS7A5201QRGRRQ1?qs=1mbolxNpo8cdxsbFt%252By4TQ%3D%3D; Arrow Part Number: TPS7A5201QRGRRQ1; Arrow Price/Stock: https://www.arrow.com/en/products/tps7a5201qrgrrq1/texas-instruments
J2 = 43045-0201: Connector; Manufacturer_Name: Molex; Datasheet Link: https://www.molex.com/pdm_docs/sd/430450200_sd.pdf; Height: 9.9mm; Manufacturer_Part_Number: 43045-0201; Mouser Part Number: 538-43045-0201; Mouser Price/Stock: https://www.mouser.co.uk/ProductDetail/Molex/43045-0201?qs=R7%2FZKp6KZ2Y51sj1nic43g%3D%3D
L1 L2 = CMP-1353-00057-5: NexarPartId: 22866641; Current Rating: 3.8A; Inductance: 4.7µH; Shielding: Shielded; Frequency: 22MHz; Series Resistance: 40mΩ; Inductance Tolerance: 20%; Saturation Current: 7.5A; Test Frequency: 100kHz; Core Material: Composite, Ferrite; DC Resistance (DCR): 37mΩ; Case/Package: Nonstandard; Width: 6.6mm; Max Operating Temperature: 125°C; Min Operating Temperature: -40°C; Termination: SMD/SMT; Max DC Current: 3.8A; Ambient Temperature Range Low: -40°C; RMS Current (Irms): 3.8A; Height: 2.8mm; REACH SVHC: Unknown; Tolerance: 20%; Composition: Wirewound; Packaging: Tape & Reel (TR); Self Resonant Frequency: 22MHz; RoHS: Compliant; Mount: Surface Mount; Length: 7.3mm; Depth: 6.6mm; Height - Seated (Max): 3.0988mm; Ambient Temperature Range High: 85°C
R9-R12 = CMP-009-00179-1: Resistor SMD 0603; Manufacturer Part Number: *; Distributor Link: *; Source: Schematic-Lib-PhilsLab.SchLib; Manufacturer: *; Design Item ID: RES_0603; LCSC: *
TP1-TP4 = CMP-020-000001-1: Test Point Round 1mm (NO BOM); Design Item ID: TEST_POINT_RND_1MM; Source: Schematic-Lib-PhilsLab.SchLib

## Nets that join several sheets
+3V3: ADC1 (8 pins), ADC1/F2 (C60_ADC1_F2.2 U6_ADC1_F2.4), ADC1/F1 (C60_ADC1_F1.2 U6_ADC1_F1.4), Main (12 pins), B1 (35 pins), B1/F1 (C54_B1_F1.2 U4_B1_F1.8), B2 (35 pins), B2/F1 (C54_B2_F1.2 U4_B2_F1.8), B3 (35 pins), B3/F1 (C54_B3_F1.2 U4_B3_F1.8), B4 (35 pins), B4/F1 (C54_B4_F1.2 U4_B4_F1.8), B5 (35 pins), B5/F1 (C54_B5_F1.2 U4_B5_F1.8), B6 (35 pins), B6/F1 (C54_B6_F1.2 U4_B6_F1.8), B7 (35 pins), B7/F1 (C54_B7_F1.2 U4_B7_F1.8), B8 (35 pins), B8/F1 (C54_B8_F1.2 U4_B8_F1.8), ADC2 (8 pins), ADC2/F2 (C60_ADC2_F2.2 U6_ADC2_F2.4), ADC2/F1 (C60_ADC2_F1.2 U6_ADC2_F1.4), B9 (35 pins), B9/F1 (C54_B9_F1.2 U4_B9_F1.8), B10 (35 pins), B10/F1 (C54_B10_F1.2 U4_B10_F1.8), B11 (35 pins), B11/F1 (C54_B11_F1.2 U4_B11_F1.8), B12 (35 pins), B12/F1 (C54_B12_F1.2 U4_B12_F1.8), B13 (35 pins), B13/F1 (C54_B13_F1.2 U4_B13_F1.8), B14 (35 pins), B14/F1 (C54_B14_F1.2 U4_B14_F1.8), B15 (35 pins), B15/F1 (C54_B15_F1.2 U4_B15_F1.8), B16 (35 pins), B16/F1 (C54_B16_F1.2 U4_B16_F1.8), PWR (10 pins)
GND: ADC1 (13 pins), ADC1/F2 (6 pins), ADC1/F1 (6 pins), Main (34 pins), B1 (35 pins), B1/F1 (C54_B1_F1.1 C55_B1_F1.1 U4_B1_F1.4), B2 (35 pins), B2/F1 (C54_B2_F1.1 C55_B2_F1.1 U4_B2_F1.4), B3 (35 pins), B3/F1 (C54_B3_F1.1 C55_B3_F1.1 U4_B3_F1.4), B4 (35 pins), B4/F1 (C54_B4_F1.1 C55_B4_F1.1 U4_B4_F1.4), B5 (35 pins), B5/F1 (C54_B5_F1.1 C55_B5_F1.1 U4_B5_F1.4), B6 (35 pins), B6/F1 (C54_B6_F1.1 C55_B6_F1.1 U4_B6_F1.4), B7 (35 pins), B7/F1 (C54_B7_F1.1 C55_B7_F1.1 U4_B7_F1.4), B8 (35 pins), B8/F1 (C54_B8_F1.1 C55_B8_F1.1 U4_B8_F1.4), ADC2 (13 pins), ADC2/F2 (6 pins), ADC2/F1 (6 pins), B9 (35 pins), B9/F1 (C54_B9_F1.1 C55_B9_F1.1 U4_B9_F1.4), B10 (35 pins), B10/F1 (C54_B10_F1.1 C55_B10_F1.1 U4_B10_F1.4), B11 (35 pins), B11/F1 (C54_B11_F1.1 C55_B11_F1.1 U4_B11_F1.4), B12 (35 pins), B12/F1 (C54_B12_F1.1 C55_B12_F1.1 U4_B12_F1.4), B13 (35 pins), B13/F1 (C54_B13_F1.1 C55_B13_F1.1 U4_B13_F1.4), B14 (35 pins), B14/F1 (C54_B14_F1.1 C55_B14_F1.1 U4_B14_F1.4), B15 (35 pins), B15/F1 (C54_B15_F1.1 C55_B15_F1.1 U4_B15_F1.4), B16 (35 pins), B16/F1 (C54_B16_F1.1 C55_B16_F1.1 U4_B16_F1.4), PWR (30 pins)
AINA0_ADC1: ADC1 (IC1_ADC1.13), ADC1/F2 (C57_ADC1_F2.2 R16_ADC1_F2.1)
AINA0_ADC2: ADC2 (IC1_ADC2.13), ADC2/F2 (C57_ADC2_F2.2 R16_ADC2_F2.1)
AINA1_ADC1: ADC1 (IC1_ADC1.12), ADC1/F2 (C56_ADC1_F2.2 R15_ADC1_F2.1)
AINA1_ADC2: ADC2 (IC1_ADC2.12), ADC2/F2 (C56_ADC2_F2.2 R15_ADC2_F2.1)
AINB0_ADC1: ADC1 (IC1_ADC1.11), ADC1/F2 (C58_ADC1_F2.2 R17_ADC1_F2.1)
AINB0_ADC2: ADC2 (IC1_ADC2.11), ADC2/F2 (C58_ADC2_F2.2 R17_ADC2_F2.1)
AINB1_ADC1: ADC1 (IC1_ADC1.10), ADC1/F2 (C59_ADC1_F2.2 R18_ADC1_F2.1)
AINB1_ADC2: ADC2 (IC1_ADC2.10), ADC2/F2 (C59_ADC2_F2.2 R18_ADC2_F2.1)
AINC0_ADC1: ADC1 (IC1_ADC1.9), ADC1/F1 (C57_ADC1_F1.2 R16_ADC1_F1.1)
AINC0_ADC2: ADC2 (IC1_ADC2.9), ADC2/F1 (C57_ADC2_F1.2 R16_ADC2_F1.1)
AINC1_ADC1: ADC1 (IC1_ADC1.8), ADC1/F1 (C56_ADC1_F1.2 R15_ADC1_F1.1)
AINC1_ADC2: ADC2 (IC1_ADC2.8), ADC2/F1 (C56_ADC2_F1.2 R15_ADC2_F1.1)
AIND0_ADC1: ADC1 (IC1_ADC1.7), ADC1/F1 (C58_ADC1_F1.2 R17_ADC1_F1.1)
AIND0_ADC2: ADC2 (IC1_ADC2.7), ADC2/F1 (C58_ADC2_F1.2 R17_ADC2_F1.1)
AIND1_ADC1: ADC1 (IC1_ADC1.6), ADC1/F1 (C59_ADC1_F1.2 R18_ADC1_F1.1)
AIND1_ADC2: ADC2 (IC1_ADC2.6), ADC2/F1 (C59_ADC2_F1.2 R18_ADC2_F1.1)
NetIC1_ADC1_18: ADC1 (IC1_ADC1.18), Main (U1.21)
NetIC1_ADC1_21: ADC1 (IC1_ADC1.21), Main (R5.1)
NetIC1_ADC1_22: ADC1 (IC1_ADC1.22), Main (R6.1)
NetIC1_ADC2_18: Main (U3.21), ADC2 (IC1_ADC2.18)
NetIC1_ADC2_21: Main (R7.1), ADC2 (IC1_ADC2.21)
NetIC1_ADC2_22: Main (R8.1), ADC2 (IC1_ADC2.22)
NetR1_ADC1_2: ADC1 (R1_ADC1.2), Main (U2.19)
NetR1_ADC2_2: Main (U2.15), ADC2 (R1_ADC2.2)
NetR2_ADC1_1: ADC1 (R2_ADC1.1), Main (U2.20)
NetR2_ADC2_1: Main (U2.16), ADC2 (R2_ADC2.1)
NetR3_ADC1_2: ADC1 (R3_ADC1.2), Main (U2.18)
NetR3_ADC2_2: Main (U2.14), ADC2 (R3_ADC2.2)
NetR4_ADC1_1: ADC1 (R4_ADC1.1), Main (U2.21)
NetR4_ADC2_1: Main (U2.17), ADC2 (R4_ADC2.1)
NetU1_15: Main (U1.15), B1 (U5_B1.14), B2 (U5_B2.14), B3 (U5_B3.14), B4 (U5_B4.14), B5 (U5_B5.14), B6 (U5_B6.14), B7 (U5_B7.14), B8 (U5_B8.14)
NetU1_16: Main (U1.16), B1 (U5_B1.15), B2 (U5_B2.15), B3 (U5_B3.15), B4 (U5_B4.15), B5 (U5_B5.15), B6 (U5_B6.15), B7 (U5_B7.15), B8 (U5_B8.15)
NetU1_17: Main (U1.17), B1 (U5_B1.16), B2 (U5_B2.16), B3 (U5_B3.16), B4 (U5_B4.16), B5 (U5_B5.16), B6 (U5_B6.16), B7 (U5_B7.16), B8 (U5_B8.16)
NetU1_18: Main (U1.18), B1 (U5_B1.17), B2 (U5_B2.17), B3 (U5_B3.17), B4 (U5_B4.17), B5 (U5_B5.17), B6 (U5_B6.17), B7 (U5_B7.17), B8 (U5_B8.17)
NetU3_15: Main (U3.15), B9 (U5_B9.14), B10 (U5_B10.14), B11 (U5_B11.14), B12 (U5_B12.14), B13 (U5_B13.14), B14 (U5_B14.14), B15 (U5_B15.14), B16 (U5_B16.14)
NetU3_16: Main (U3.16), B9 (U5_B9.15), B10 (U5_B10.15), B11 (U5_B11.15), B12 (U5_B12.15), B13 (U5_B13.15), B14 (U5_B14.15), B15 (U5_B15.15), B16 (U5_B16.15)
NetU3_17: Main (U3.17), B9 (U5_B9.16), B10 (U5_B10.16), B11 (U5_B11.16), B12 (U5_B12.16), B13 (U5_B13.16), B14 (U5_B14.16), B15 (U5_B15.16), B16 (U5_B16.16)
NetU3_18: Main (U3.18), B9 (U5_B9.17), B10 (U5_B10.17), B11 (U5_B11.17), B12 (U5_B12.17), B13 (U5_B13.17), B14 (U5_B14.17), B15 (U5_B15.17), B16 (U5_B16.17)
S_OUT_B1: B1 (U5_B1.28), B1/F1 (U4_B1_F1.3)
S_OUT_B2: B2 (U5_B2.28), B2/F1 (U4_B2_F1.3)
S_OUT_B3: B3 (U5_B3.28), B3/F1 (U4_B3_F1.3)
S_OUT_B4: B4 (U5_B4.28), B4/F1 (U4_B4_F1.3)
S_OUT_B5: B5 (U5_B5.28), B5/F1 (U4_B5_F1.3)
S_OUT_B6: B6 (U5_B6.28), B6/F1 (U4_B6_F1.3)
S_OUT_B7: B7 (U5_B7.28), B7/F1 (U4_B7_F1.3)
S_OUT_B8: B8 (U5_B8.28), B8/F1 (U4_B8_F1.3)
S_OUT_B9: B9 (U5_B9.28), B9/F1 (U4_B9_F1.3)
S_OUT_B10: B10 (U5_B10.28), B10/F1 (U4_B10_F1.3)
S_OUT_B11: B11 (U5_B11.28), B11/F1 (U4_B11_F1.3)
S_OUT_B12: B12 (U5_B12.28), B12/F1 (U4_B12_F1.3)
S_OUT_B13: B13 (U5_B13.28), B13/F1 (U4_B13_F1.3)
S_OUT_B14: B14 (U5_B14.28), B14/F1 (U4_B14_F1.3)
S_OUT_B15: B15 (U5_B15.28), B15/F1 (U4_B15_F1.3)
S_OUT_B16: B16 (U5_B16.28), B16/F1 (U4_B16_F1.3)